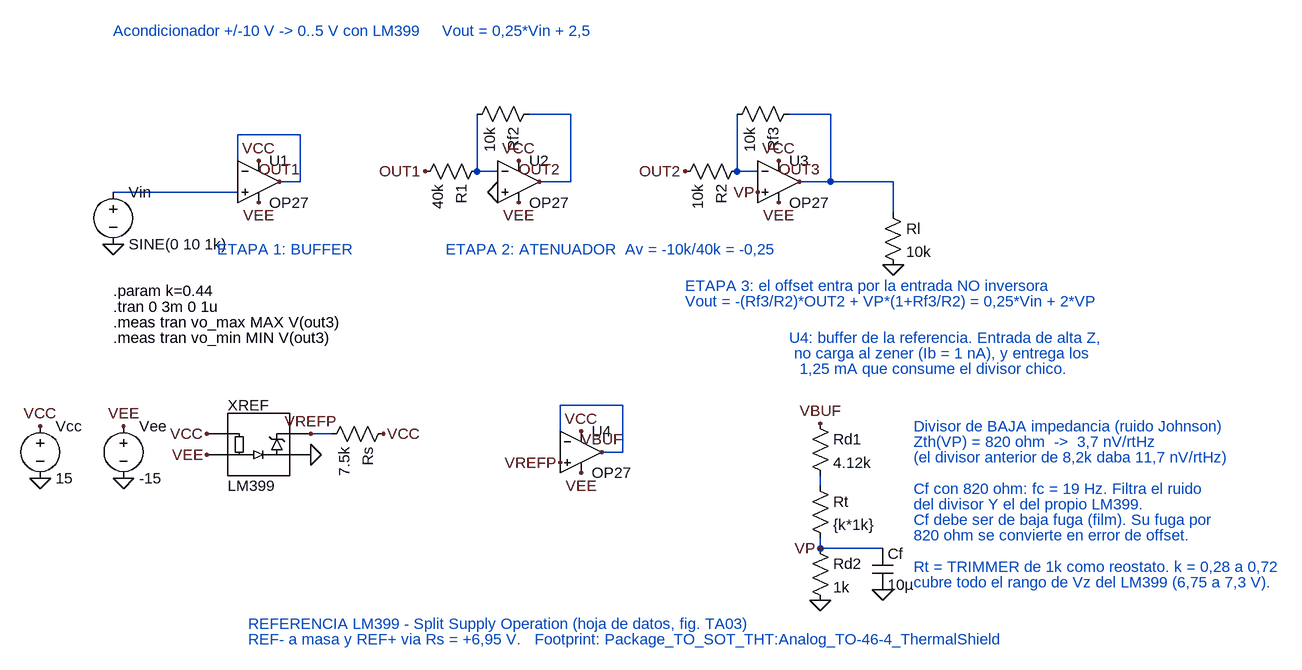
[diagram p0: schematic acondicionador_v5_ref_bajo_ruido.asc]
acondicionador_v5_ref_bajo_ruido.asc, the LTspice schematic file:
Version 4.1
SHEET 1 2060 1000
WIRE 880 160 816 160
WIRE 1280 160 1216 160
WIRE 464 192 368 192
WIRE 368 248 368 192
WIRE 736 248 736 160
WIRE 768 248 736 248
WIRE 1136 248 1136 160
WIRE 1168 248 1136 248
WIRE 464 264 464 192
WIRE 464 264 432 264
WIRE 880 264 880 160
WIRE 880 264 832 264
WIRE 1280 264 1280 160
WIRE 1280 264 1232 264
WIRE 1376 264 1280 264
WIRE 368 280 176 280
WIRE 1376 312 1376 264
WIRE 960 608 864 608
WIRE 512 652 480 652
WIRE 864 664 864 608
WIRE 960 680 960 608
WIRE 960 680 928 680
WIRE 1264 732 1264 716
WIRE 1264 828 1264 812
WIRE 1360 828 1264 828
FLAG 176 360 0
FLAG 64 640 VCC
FLAG 64 720 0
FLAG 192 640 VEE
FLAG 192 720 0
FLAG 400 232 VCC
FLAG 400 296 VEE
FLAG 432 264 OUT1
FLAG 656 248 OUT1
FLAG 768 280 0
FLAG 800 232 VCC
FLAG 800 296 VEE
FLAG 832 264 OUT2
FLAG 1056 248 OUT2
FLAG 1168 280 VP
FLAG 1200 232 VCC
FLAG 1200 296 VEE
FLAG 1232 264 OUT3
FLAG 1376 392 0
FLAG 320 652 VCC
FLAG 320 684 VEE
FLAG 480 684 0
FLAG 480 652 VREFP
FLAG 592 652 VCC
FLAG 864 696 VREFP
FLAG 896 648 VCC
FLAG 896 712 VEE
FLAG 928 680 VBUF
FLAG 1264 636 VBUF
FLAG 1264 828 VP
FLAG 1264 908 0
FLAG 1360 892 0
SYMBOL voltage 176 264 R0
SYMATTR InstName Vin
SYMATTR Value SINE(0 10 1k)
SYMBOL OP27 400 200 R0
SYMATTR InstName U1
SYMBOL res 752 232 R90
SYMATTR InstName R1
SYMATTR Value 40k
SYMBOL res 832 144 R90
SYMATTR InstName Rf2
SYMATTR Value 10k
SYMBOL OP27 800 200 R0
SYMATTR InstName U2
SYMBOL res 1152 232 R90
SYMATTR InstName R2
SYMATTR Value 10k
SYMBOL res 1232 144 R90
SYMATTR InstName Rf3
SYMATTR Value 10k
SYMBOL OP27 1200 200 R0
SYMATTR InstName U3
SYMBOL res 1360 296 R0
SYMATTR InstName Rl
SYMATTR Value 10k
SYMBOL voltage 64 624 R0
SYMATTR InstName Vcc
SYMATTR Value 15
SYMBOL voltage 192 624 R0
SYMATTR InstName Vee
SYMATTR Value -15
SYMBOL LM399 400 604 R0
SYMATTR InstName XREF
SYMBOL res 608 636 R90
SYMATTR InstName Rs
SYMATTR Value 7.5k
SYMBOL OP27 896 616 R0
SYMATTR InstName U4
SYMBOL res 1248 620 R0
SYMATTR InstName Rd1
SYMATTR Value 4.12k
SYMBOL res 1248 716 R0
SYMATTR InstName Rt
SYMATTR Value {k*1k}
SYMBOL res 1248 812 R0
SYMATTR InstName Rd2
SYMATTR Value 1k
SYMBOL cap 1344 828 R0
SYMATTR InstName Cf
SYMATTR Value 10µ
TEXT 176 432 Left 2 !.param k=0.44
TEXT 176 456 Left 2 !.tran 0 3m 0 1u
TEXT 176 480 Left 2 !.meas tran vo_max MAX V(out3)
TEXT 176 504 Left 2 !.meas tran vo_min MIN V(out3)
TEXT 176 32 Left 2 ;Acondicionador +/-10 V -> 0..5 V con LM399     Vout = 0,25*Vin + 2,5
TEXT 336 368 Left 2 ;ETAPA 1: BUFFER
TEXT 688 368 Left 2 ;ETAPA 2: ATENUADOR  Av = -10k/40k = -0,25
TEXT 1056 424 Left 2 ;ETAPA 3: el offset entra por la entrada NO inversora
TEXT 1056 448 Left 2 ;Vout = -(Rf3/R2)*OUT2 + VP*(1+Rf3/R2) = 0,25*Vin + 2*VP
TEXT 1216 504 Left 2 ;U4: buffer de la referencia. Entrada de alta Z,
TEXT 1224 528 Left 2 ;no carga al zener (Ib = 1 nA), y entrega los
TEXT 1232 552 Left 2 ;1,25 mA que consume el divisor chico.
TEXT 1408 640 Left 2 ;Divisor de BAJA impedancia (ruido Johnson)
TEXT 1408 664 Left 2 ;Zth(VP) = 820 ohm  ->  3,7 nV/rtHz
TEXT 1408 688 Left 2 ;(el divisor anterior de 8,2k daba 11,7 nV/rtHz)
TEXT 1408 736 Left 2 ;Cf con 820 ohm: fc = 19 Hz. Filtra el ruido
TEXT 1408 760 Left 2 ;del divisor Y el del propio LM399.
TEXT 1408 784 Left 2 ;Cf debe ser de baja fuga (film). Su fuga por
TEXT 1408 808 Left 2 ;820 ohm se convierte en error de offset.
TEXT 1408 856 Left 2 ;Rt = TRIMMER de 1k como reostato. k = 0,28 a 0,72
TEXT 1408 880 Left 2 ;cubre todo el rango de Vz del LM399 (6,75 a 7,3 V).
TEXT 384 944 Left 2 ;REFERENCIA LM399 - Split Supply Operation (hoja de datos, fig. TA03)
TEXT 384 968 Left 2 ;REF- a masa y REF+ via Rs = +6,95 V.   Footprint: Package_TO_SOT_THT:Analog_TO-46-4_ThermalShield

The netlist it stands for:
* acondicionador_v5_ref_bajo_ruido.asc
Vin N003 0 SINE(0 10 1k)
X§U1 N003 OUT1 VCC VEE OUT1 OP27  ; pins In+ In- V+ V- OUT
R1 N001 OUT1 40k
Rf2 OUT2 N001 10k
X§U2 0 N001 VCC VEE OUT2 OP27  ; pins In+ In- V+ V- OUT
R2 N002 OUT2 10k
Rf3 OUT3 N002 10k
X§U3 VP N002 VCC VEE OUT3 OP27  ; pins In+ In- V+ V- OUT
Rl OUT3 0 10k
Vcc VCC 0 15
Vee VEE 0 -15
X§XREF VREFP 0 VCC VEE LM399  ; pins REF+ REF- HTR+ HTR-
Rs VCC VREFP 7.5k
X§U4 VREFP VBUF VCC VEE VBUF OP27  ; pins In+ In- V+ V- OUT
Rd1 VBUF N004 4.12k
Rt N004 VP {k*1k}
Rd2 VP 0 1k
Cf VP 0 10µ
.param k=0.44
.tran 0 3m 0 1u
.meas tran vo_max MAX V(out3)
.meas tran vo_min MIN V(out3)
* Acondicionador +/-10 V -> 0..5 V con LM399     Vout = 0,25*Vin + 2,5
* ETAPA 1: BUFFER
* ETAPA 2: ATENUADOR  Av = -10k/40k = -0,25
* ETAPA 3: el offset entra por la entrada NO inversora
* Vout = -(Rf3/R2)*OUT2 + VP*(1+Rf3/R2) = 0,25*Vin + 2*VP
* U4: buffer de la referencia. Entrada de alta Z,
* no carga al zener (Ib = 1 nA), y entrega los
* 1,25 mA que consume el divisor chico.
* Divisor de BAJA impedancia (ruido Johnson)
* Zth(VP) = 820 ohm  ->  3,7 nV/rtHz
* (el divisor anterior de 8,2k daba 11,7 nV/rtHz)
* Cf con 820 ohm: fc = 19 Hz. Filtra el ruido
* del divisor Y el del propio LM399.
* Cf debe ser de baja fuga (film). Su fuga por
* 820 ohm se convierte en error de offset.
* Rt = TRIMMER de 1k como reostato. k = 0,28 a 0,72
* cubre todo el rango de Vz del LM399 (6,75 a 7,3 V).
* REFERENCIA LM399 - Split Supply Operation (hoja de datos, fig. TA03)
* REF- a masa y REF+ via Rs = +6,95 V.   Footprint: Package_TO_SOT_THT:Analog_TO-46-4_ThermalShield
.lib ADI.lib
.lib LM399.lib
.backanno
.end